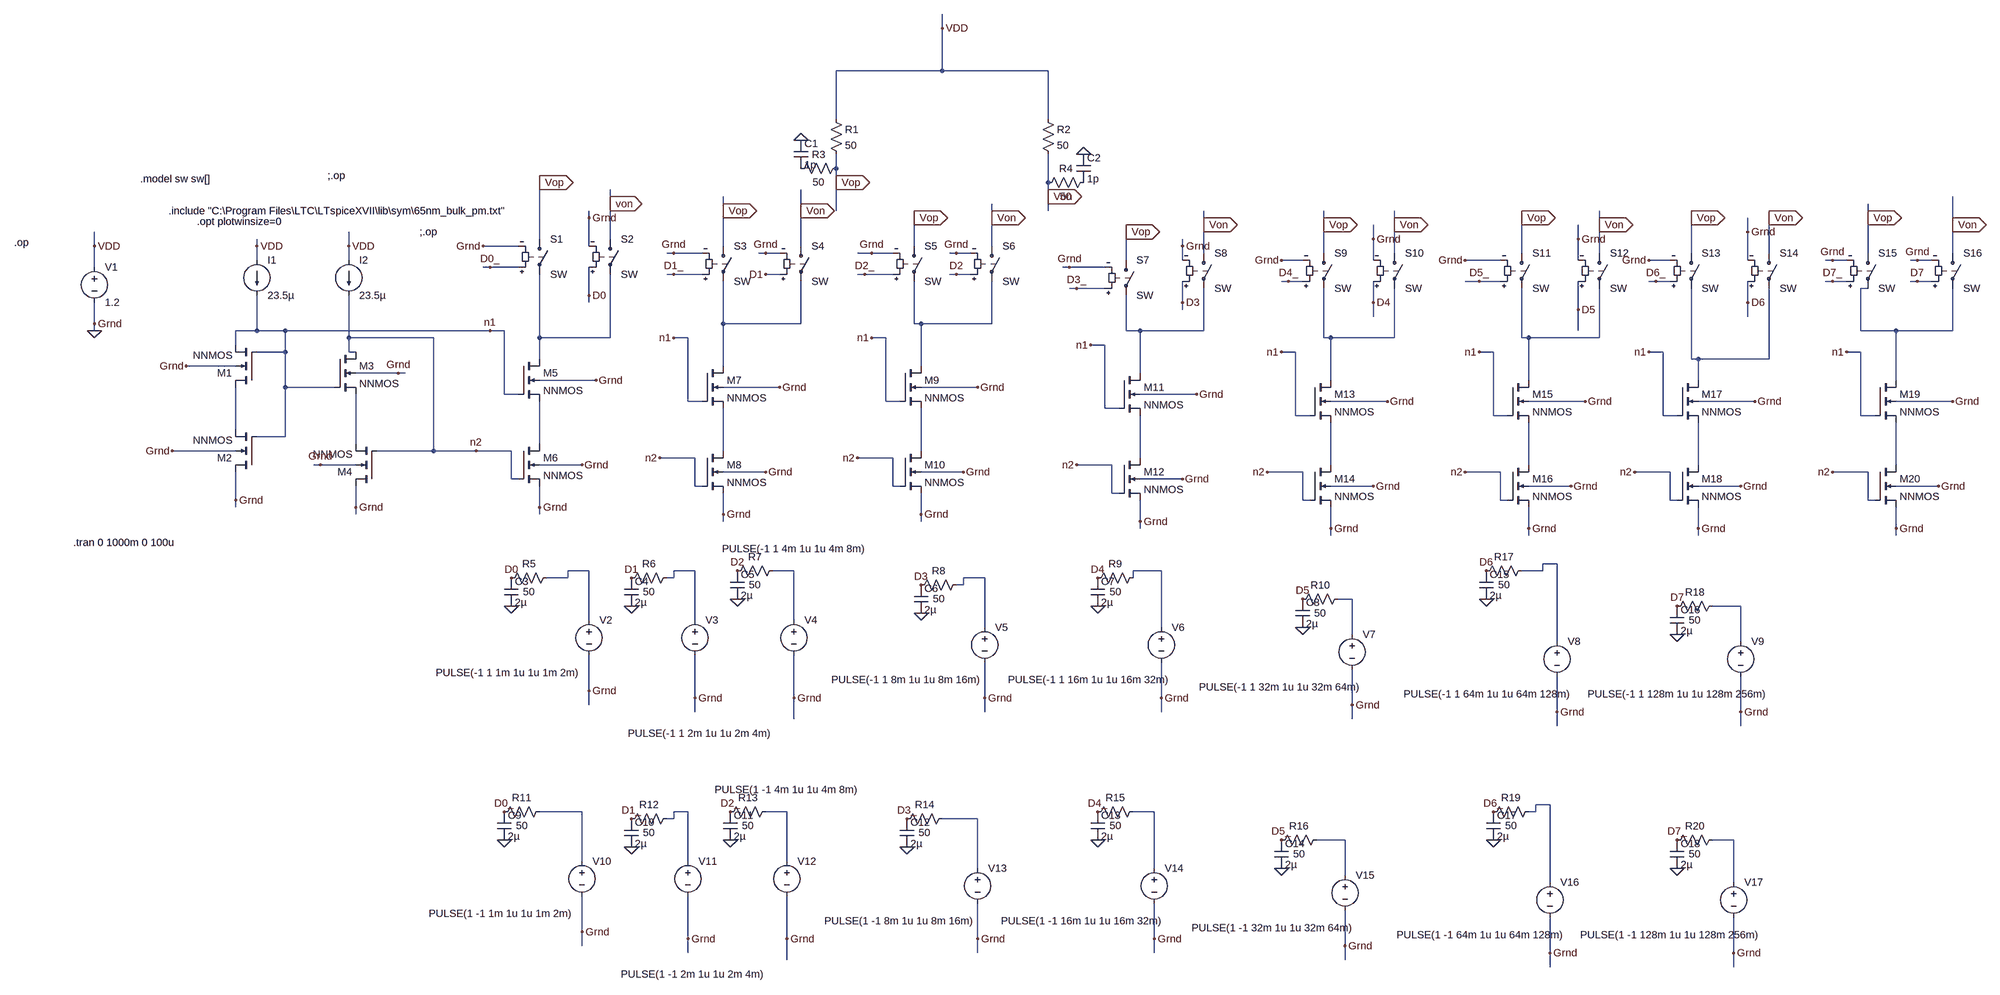
[diagram p0: schematic 8bitDACcurrent_steering.asc]
8bitDACcurrent_steering.asc, the LTspice schematic file:
Version 4
SHEET 1 3984 1160
WIRE 1616 -1056 1616 -1088
WIRE 1616 -960 1616 -1056
WIRE 1616 -960 1376 -960
WIRE 1856 -960 1616 -960
WIRE 1376 -832 1376 -960
WIRE 1856 -832 1856 -960
WIRE 1376 -720 1376 -752
WIRE 704 -688 704 -704
WIRE 1376 -688 1376 -720
WIRE 1856 -688 1856 -752
WIRE 1856 -656 1856 -688
WIRE 864 -640 864 -672
WIRE 1120 -624 1120 -656
WIRE 1296 -624 1296 -672
WIRE 1376 -624 1376 -688
WIRE 1856 -624 1856 -656
WIRE 816 -608 816 -624
WIRE 1552 -608 1552 -624
WIRE 1728 -608 1728 -640
WIRE 2928 -608 2928 -624
WIRE 3312 -608 3312 -624
WIRE 3488 -608 3488 -624
WIRE 3712 -608 3712 -640
WIRE 2208 -592 2208 -624
WIRE 2480 -592 2480 -624
WIRE 2640 -592 2640 -624
WIRE 3104 -592 3104 -624
WIRE 3904 -592 3904 -656
WIRE 2032 -576 2032 -592
WIRE 3440 -576 3440 -608
WIRE 704 -560 704 -688
WIRE 864 -560 864 -640
WIRE 2592 -560 2592 -592
WIRE 3056 -560 3056 -592
WIRE -304 -544 -304 -576
WIRE 64 -544 64 -560
WIRE 272 -544 272 -576
WIRE 656 -544 576 -544
WIRE 816 -544 816 -608
WIRE 1120 -544 1120 -624
WIRE 1296 -544 1296 -624
WIRE 1552 -544 1552 -608
WIRE 1728 -544 1728 -608
WIRE 2160 -544 2160 -560
WIRE 1008 -528 992 -528
WIRE 1072 -528 1008 -528
WIRE 1216 -528 1200 -528
WIRE 1248 -528 1216 -528
WIRE 1456 -528 1424 -528
WIRE 1504 -528 1456 -528
WIRE 1648 -528 1632 -528
WIRE 1680 -528 1648 -528
WIRE 2208 -528 2208 -592
WIRE 2480 -528 2480 -592
WIRE 2640 -528 2640 -592
WIRE 2928 -528 2928 -608
WIRE 3104 -528 3104 -592
WIRE 3312 -528 3312 -608
WIRE 3488 -528 3488 -608
WIRE 3712 -528 3712 -608
WIRE 3904 -528 3904 -592
WIRE 64 -512 64 -544
WIRE 272 -512 272 -544
WIRE 2032 -512 2032 -576
WIRE 2160 -512 2160 -544
WIRE 2432 -512 2384 -512
WIRE 2592 -512 2592 -560
WIRE 2880 -512 2800 -512
WIRE 3056 -512 3056 -560
WIRE 3264 -512 3216 -512
WIRE 3440 -512 3440 -576
WIRE 3632 -512 3616 -512
WIRE 3664 -512 3632 -512
WIRE 3824 -512 3808 -512
WIRE 3856 -512 3824 -512
WIRE -304 -496 -304 -544
WIRE 592 -496 576 -496
WIRE 656 -496 592 -496
WIRE 1904 -496 1888 -496
WIRE 1984 -496 1904 -496
WIRE 1008 -480 992 -480
WIRE 1072 -480 1008 -480
WIRE 1248 -480 1216 -480
WIRE 1440 -480 1424 -480
WIRE 1504 -480 1440 -480
WIRE 1648 -480 1632 -480
WIRE 1680 -480 1648 -480
WIRE 2400 -464 2384 -464
WIRE 2432 -464 2400 -464
WIRE 2832 -464 2800 -464
WIRE 2880 -464 2832 -464
WIRE 3232 -464 3216 -464
WIRE 3264 -464 3232 -464
WIRE 3632 -464 3616 -464
WIRE 3664 -464 3632 -464
WIRE 3824 -464 3808 -464
WIRE 3856 -464 3824 -464
WIRE 1920 -448 1904 -448
WIRE 1984 -448 1920 -448
WIRE 3712 -448 3696 -448
WIRE 816 -432 816 -496
WIRE 816 -416 816 -432
WIRE 2160 -416 2160 -464
WIRE 2592 -416 2592 -464
WIRE 3440 -416 3440 -464
WIRE 2160 -400 2160 -416
WIRE 3056 -400 3056 -464
WIRE 2592 -384 2592 -416
WIRE 3440 -384 3440 -416
WIRE -304 -368 -304 -416
WIRE 1120 -368 1120 -464
WIRE 1296 -368 1296 -464
WIRE 1296 -368 1120 -368
WIRE 1552 -368 1552 -464
WIRE 1568 -368 1552 -368
WIRE 1728 -368 1728 -464
WIRE 1728 -368 1568 -368
WIRE -304 -352 -304 -368
WIRE 64 -352 64 -432
WIRE 64 -352 16 -352
WIRE 128 -352 64 -352
WIRE 592 -352 128 -352
WIRE 624 -352 592 -352
WIRE 2032 -352 2032 -432
WIRE 2064 -352 2032 -352
WIRE 2208 -352 2208 -448
WIRE 2208 -352 2064 -352
WIRE 3056 -352 3056 -400
WIRE 3696 -352 3696 -448
WIRE 3776 -352 3696 -352
WIRE 3904 -352 3904 -448
WIRE 3904 -352 3776 -352
WIRE 272 -336 272 -432
WIRE 464 -336 272 -336
WIRE 704 -336 704 -480
WIRE 864 -336 864 -480
WIRE 864 -336 704 -336
WIRE 1040 -336 1008 -336
WIRE 1488 -336 1456 -336
WIRE 2480 -336 2480 -448
WIRE 2496 -336 2480 -336
WIRE 2640 -336 2640 -448
WIRE 2640 -336 2496 -336
WIRE 2928 -336 2928 -448
WIRE 2944 -336 2928 -336
WIRE 3104 -336 3104 -448
WIRE 3104 -336 2944 -336
WIRE 16 -320 16 -352
WIRE 1984 -320 1952 -320
WIRE 128 -304 128 -352
WIRE 128 -304 64 -304
WIRE 272 -304 272 -336
WIRE 288 -304 272 -304
WIRE 2416 -304 2384 -304
WIRE 2864 -304 2832 -304
WIRE 3248 -304 3216 -304
WIRE 3696 -304 3664 -304
WIRE 704 -288 704 -336
WIRE 3312 -288 3312 -448
WIRE 3328 -288 3312 -288
WIRE 3488 -288 3488 -448
WIRE 3488 -288 3328 -288
WIRE 16 -272 -96 -272
WIRE 1120 -272 1120 -368
WIRE 1568 -272 1568 -368
WIRE 384 -256 288 -256
WIRE 400 -256 384 -256
WIRE 2064 -256 2064 -352
WIRE 832 -240 704 -240
WIRE 2496 -240 2496 -336
WIRE 2944 -240 2944 -336
WIRE 3328 -240 3328 -288
WIRE 3776 -240 3776 -352
WIRE 128 -224 128 -304
WIRE 240 -224 128 -224
WIRE 1248 -224 1120 -224
WIRE 1696 -224 1568 -224
WIRE 624 -208 624 -352
WIRE 656 -208 624 -208
WIRE 2192 -208 2064 -208
WIRE 1040 -192 1040 -336
WIRE 1072 -192 1040 -192
WIRE 1488 -192 1488 -336
WIRE 1520 -192 1488 -192
WIRE 2624 -192 2496 -192
WIRE 3072 -192 2944 -192
WIRE 3456 -192 3328 -192
WIRE 3904 -192 3776 -192
WIRE 1984 -176 1984 -320
WIRE 2016 -176 1984 -176
WIRE 2416 -160 2416 -304
WIRE 2448 -160 2416 -160
WIRE 2864 -160 2864 -304
WIRE 2896 -160 2864 -160
WIRE 3248 -160 3248 -304
WIRE 3280 -160 3248 -160
WIRE 3696 -160 3696 -304
WIRE 3728 -160 3696 -160
WIRE 16 -128 16 -224
WIRE 128 -112 128 -224
WIRE 128 -112 64 -112
WIRE 288 -96 288 -208
WIRE 704 -96 704 -192
WIRE 16 -80 -128 -80
WIRE 464 -80 464 -336
WIRE 464 -80 336 -80
WIRE 560 -80 464 -80
WIRE 640 -80 560 -80
WIRE 1120 -80 1120 -176
WIRE 1568 -80 1568 -176
WIRE 1056 -64 976 -64
WIRE 1504 -64 1424 -64
WIRE 2064 -64 2064 -160
WIRE 208 -48 192 -48
WIRE 288 -48 208 -48
WIRE 800 -48 704 -48
WIRE 2000 -48 1920 -48
WIRE 2496 -48 2496 -144
WIRE 2944 -48 2944 -144
WIRE 3328 -48 3328 -144
WIRE 3776 -48 3776 -144
WIRE 1216 -32 1120 -32
WIRE 1664 -32 1568 -32
WIRE 2432 -32 2352 -32
WIRE 2880 -32 2800 -32
WIRE 3264 -32 3184 -32
WIRE 3712 -32 3632 -32
WIRE 640 -16 640 -80
WIRE 656 -16 640 -16
WIRE 2160 -16 2064 -16
WIRE 1056 0 1056 -64
WIRE 1072 0 1056 0
WIRE 1504 0 1504 -64
WIRE 1520 0 1504 0
WIRE 2592 0 2496 0
WIRE 3040 0 2944 0
WIRE 3424 0 3328 0
WIRE 3872 0 3776 0
WIRE 2000 16 2000 -48
WIRE 2016 16 2000 16
WIRE 16 32 16 -32
WIRE 2432 32 2432 -32
WIRE 2448 32 2432 32
WIRE 2880 32 2880 -32
WIRE 2896 32 2880 32
WIRE 3264 32 3264 -32
WIRE 3280 32 3264 32
WIRE 3712 32 3712 -32
WIRE 3728 32 3712 32
WIRE 16 48 16 32
WIRE 288 48 288 0
WIRE 704 48 704 0
WIRE 288 64 288 48
WIRE 704 64 704 48
WIRE 1120 64 1120 16
WIRE 1568 64 1568 16
WIRE 1120 80 1120 64
WIRE 1568 80 1568 64
WIRE 2064 80 2064 32
WIRE 2064 96 2064 80
WIRE 2496 96 2496 48
WIRE 2944 96 2944 48
WIRE 3328 96 3328 48
WIRE 3776 96 3776 48
WIRE 2496 112 2496 96
WIRE 2944 112 2944 96
WIRE 3328 112 3328 96
WIRE 3776 112 3776 96
WIRE 3008 176 2976 176
WIRE 816 192 768 192
WIRE 1056 192 1008 192
WIRE 1280 192 1232 192
WIRE 2112 192 2048 192
WIRE 2976 192 2976 176
WIRE 2976 192 2928 192
WIRE 768 208 768 192
WIRE 768 208 720 208
WIRE 1008 208 1008 192
WIRE 1008 208 992 208
WIRE 1712 208 1664 208
WIRE 2048 208 2048 192
WIRE 1664 224 1664 208
WIRE 1664 224 1648 224
WIRE 2544 256 2512 256
WIRE 3424 272 3360 272
WIRE 816 304 816 192
WIRE 1056 304 1056 192
WIRE 1280 304 1280 192
WIRE 1712 320 1712 208
WIRE 2112 320 2112 192
WIRE 2544 336 2544 256
WIRE 3008 352 3008 176
WIRE 3424 352 3424 272
WIRE 816 464 816 384
WIRE 1056 480 1056 384
WIRE 1280 480 1280 384
WIRE 1712 480 1712 400
WIRE 2112 480 2112 400
WIRE 816 496 816 464
WIRE 2544 496 2544 416
WIRE 1056 512 1056 480
WIRE 1712 512 1712 480
WIRE 2112 512 2112 480
WIRE 3008 512 3008 432
WIRE 3424 512 3424 432
WIRE 1280 528 1280 480
WIRE 2544 528 2544 496
WIRE 3008 544 3008 512
WIRE 3424 544 3424 512
WIRE 2992 752 2960 752
WIRE 800 768 704 768
WIRE 1040 768 1008 768
WIRE 1264 768 1216 768
WIRE 2096 768 2048 768
WIRE 2960 768 2960 752
WIRE 2960 768 2944 768
WIRE 1008 784 1008 768
WIRE 1008 784 992 784
WIRE 1696 784 1616 784
WIRE 2528 832 2464 832
WIRE 3408 832 3360 832
WIRE 800 880 800 768
WIRE 1040 880 1040 768
WIRE 1264 880 1264 768
WIRE 1696 896 1696 784
WIRE 2096 896 2096 768
WIRE 2528 912 2528 832
WIRE 2992 928 2992 752
WIRE 3408 928 3408 832
WIRE 800 1040 800 960
WIRE 1040 1056 1040 960
WIRE 1264 1056 1264 960
WIRE 1696 1056 1696 976
WIRE 2096 1056 2096 976
WIRE 800 1072 800 1040
WIRE 2528 1072 2528 992
WIRE 1040 1088 1040 1056
WIRE 1696 1088 1696 1056
WIRE 2096 1088 2096 1056
WIRE 2992 1088 2992 1008
WIRE 3408 1088 3408 1008
WIRE 1264 1104 1264 1056
WIRE 2528 1104 2528 1072
WIRE 2992 1120 2992 1088
WIRE 3408 1120 3408 1088
FLAG -304 -352 0
FLAG -304 -544 VDD
FLAG 64 -544 VDD
FLAG 272 -544 VDD
FLAG -304 -368 Grnd
FLAG -96 -272 Grnd
FLAG -128 -80 Grnd
FLAG 16 32 Grnd
FLAG 288 48 Grnd
FLAG 208 -48 Grnd
FLAG 800 -48 Grnd
FLAG 704 48 Grnd
FLAG 832 -240 Grnd
FLAG 384 -256 Grnd
FLAG 816 464 Grnd
FLAG 1056 480 Grnd
FLAG 1280 480 Grnd
FLAG 640 208 D0
FLAG 912 208 D1
FLAG 1152 192 D2
FLAG 1712 480 Grnd
FLAG 2112 480 Grnd
FLAG 2544 496 Grnd
FLAG 3008 512 Grnd
FLAG 3424 512 Grnd
FLAG 1568 224 D3
FLAG 1968 208 D4
FLAG 2432 256 D5
FLAG 2848 192 D6
FLAG 3280 272 D7
FLAG 592 -352 n1
FLAG 560 -80 n2
FLAG 1216 -32 Grnd
FLAG 1120 64 Grnd
FLAG 1248 -224 Grnd
FLAG 1008 -336 n1
FLAG 976 -64 n2
FLAG 1664 -32 Grnd
FLAG 1568 64 Grnd
FLAG 1696 -224 Grnd
FLAG 1456 -336 n1
FLAG 1424 -64 n2
FLAG 2160 -16 Grnd
FLAG 2064 80 Grnd
FLAG 2192 -208 Grnd
FLAG 1952 -320 n1
FLAG 1920 -48 n2
FLAG 2592 0 Grnd
FLAG 2496 96 Grnd
FLAG 2624 -192 Grnd
FLAG 2384 -304 n1
FLAG 2352 -32 n2
FLAG 3040 0 Grnd
FLAG 2944 96 Grnd
FLAG 3072 -192 Grnd
FLAG 2832 -304 n1
FLAG 2800 -32 n2
FLAG 3424 0 Grnd
FLAG 3328 96 Grnd
FLAG 3456 -192 Grnd
FLAG 3216 -304 n1
FLAG 3184 -32 n2
FLAG 3872 0 Grnd
FLAG 3776 96 Grnd
FLAG 3904 -192 Grnd
FLAG 3664 -304 n1
FLAG 3632 -32 n2
FLAG 800 1040 Grnd
FLAG 1040 1056 Grnd
FLAG 1264 1056 Grnd
FLAG 624 768 D0_
FLAG 912 784 D1_
FLAG 1136 768 D2_
FLAG 1696 1056 Grnd
FLAG 2096 1056 Grnd
FLAG 2528 1072 Grnd
FLAG 2992 1088 Grnd
FLAG 3408 1088 Grnd
FLAG 1536 784 D3_
FLAG 1968 768 D4_
FLAG 2384 832 D5_
FLAG 2864 768 D6_
FLAG 3280 832 D7_
FLAG 1376 -688 Vop
IOPIN 1376 -688 Out
FLAG 1856 -656 Von
IOPIN 1856 -656 Out
FLAG 1616 -1056 VDD
FLAG 704 -688 Vop
IOPIN 704 -688 Out
FLAG 1120 -624 Vop
IOPIN 1120 -624 Out
FLAG 1552 -608 Vop
IOPIN 1552 -608 Out
FLAG 2032 -576 Vop
IOPIN 2032 -576 Out
FLAG 2480 -592 Vop
IOPIN 2480 -592 Out
FLAG 2928 -608 Vop
IOPIN 2928 -608 Out
FLAG 3312 -608 Vop
IOPIN 3312 -608 Out
FLAG 3712 -608 Vop
IOPIN 3712 -608 Out
FLAG 1296 -624 Von
IOPIN 1296 -624 Out
FLAG 1728 -608 Von
IOPIN 1728 -608 Out
FLAG 2208 -592 Von
IOPIN 2208 -592 Out
FLAG 2640 -592 Von
IOPIN 2640 -592 Out
FLAG 3104 -592 Von
IOPIN 3104 -592 Out
FLAG 3488 -608 Von
IOPIN 3488 -608 Out
FLAG 3904 -592 Von
IOPIN 3904 -592 Out
FLAG 576 -544 Grnd
FLAG 816 -608 Grnd
FLAG 1008 -528 Grnd
FLAG 1216 -528 Grnd
FLAG 1456 -528 Grnd
FLAG 1648 -528 Grnd
FLAG 1904 -496 Grnd
FLAG 2160 -544 Grnd
FLAG 2384 -512 Grnd
FLAG 2592 -560 Grnd
FLAG 2800 -512 Grnd
FLAG 3056 -560 Grnd
FLAG 3216 -512 Grnd
FLAG 3440 -576 Grnd
FLAG 3632 -512 Grnd
FLAG 3824 -512 Grnd
FLAG 816 -432 D0
FLAG 1216 -480 D1
FLAG 592 -496 D0_
FLAG 1008 -480 D1_
FLAG 1440 -480 D2_
FLAG 1648 -480 D2
FLAG 1920 -448 D3_
FLAG 2160 -416 D3
FLAG 2400 -464 D4_
FLAG 2592 -416 D4
FLAG 2832 -464 D5_
FLAG 3056 -400 D5
FLAG 3232 -464 D6_
FLAG 3440 -416 D6
FLAG 3632 -464 D7_
FLAG 3824 -464 D7
FLAG 1296 -784 0
FLAG 1936 -752 0
FLAG 640 272 0
FLAG 912 272 0
FLAG 1152 256 0
FLAG 1568 288 0
FLAG 1968 272 0
FLAG 2432 320 0
FLAG 624 832 0
FLAG 912 848 0
FLAG 1136 832 0
FLAG 1536 848 0
FLAG 1968 832 0
FLAG 2384 896 0
FLAG 2848 256 0
FLAG 3280 336 0
FLAG 2864 832 0
FLAG 3280 896 0
FLAG 864 -640 von
IOPIN 864 -640 Out
SYMBOL current 64 -512 R0
WINDOW 123 0 0 Left 0
WINDOW 39 0 0 Left 0
SYMATTR InstName I1
SYMATTR Value 23.5µ
SYMBOL current 272 -512 R0
WINDOW 123 0 0 Left 0
WINDOW 39 0 0 Left 0
SYMATTR InstName I2
SYMATTR Value 23.5µ
SYMBOL nmos4 64 -224 R180
SYMATTR InstName M1
SYMATTR Value NNMOS
SYMATTR Value2 l=0.3u w=6u
SYMBOL nmos4 64 -32 R180
SYMATTR InstName M2
SYMATTR Value NNMOS
SYMATTR Value2 l=0.3u w=2u
SYMBOL nmos4 240 -304 R0
SYMATTR InstName M3
SYMATTR Value NNMOS
SYMATTR Value2 l=0.3u w=6u
SYMBOL nmos4 336 0 R180
SYMATTR InstName M4
SYMATTR Value NNMOS
SYMATTR Value2 l=0.3u w=6u
SYMBOL nmos4 656 -288 R0
SYMATTR InstName M5
SYMATTR Value NNMOS
SYMATTR Value2 l=0.3u w=6u
SYMBOL nmos4 656 -96 R0
SYMATTR InstName M6
SYMATTR Value NNMOS
SYMATTR Value2 l=0.3u w=6u
SYMBOL voltage -304 -512 R0
WINDOW 123 0 0 Left 0
WINDOW 39 0 0 Left 0
SYMATTR InstName V1
SYMATTR Value 1.2
SYMBOL voltage 816 288 R0
WINDOW 3 -347 135 Left 2
WINDOW 123 0 0 Left 0
WINDOW 39 0 0 Left 0
SYMATTR Value PULSE(-1 1 1m 1u 1u 1m 2m)
SYMATTR InstName V2
SYMBOL voltage 1056 288 R0
WINDOW 3 -152 272 Left 2
WINDOW 123 0 0 Left 0
WINDOW 39 0 0 Left 0
SYMATTR Value PULSE(-1 1 2m 1u 1u 2m 4m)
SYMATTR InstName V3
SYMBOL voltage 1280 288 R0
WINDOW 3 -163 -146 Left 2
WINDOW 123 0 0 Left 0
WINDOW 39 0 0 Left 0
SYMATTR Value PULSE(-1 1 4m 1u 1u 4m 8m)
SYMATTR InstName V4
SYMBOL voltage 1712 304 R0
WINDOW 3 -347 135 Left 2
WINDOW 123 0 0 Left 0
WINDOW 39 0 0 Left 0
SYMATTR Value PULSE(-1 1 8m 1u 1u 8m 16m)
SYMATTR InstName V5
SYMBOL voltage 2112 304 R0
WINDOW 3 -347 135 Left 2
WINDOW 123 0 0 Left 0
WINDOW 39 0 0 Left 0
SYMATTR Value PULSE(-1 1 16m 1u 1u 16m 32m)
SYMATTR InstName V6
SYMBOL voltage 2544 320 R0
WINDOW 3 -347 135 Left 2
WINDOW 123 0 0 Left 0
WINDOW 39 0 0 Left 0
SYMATTR Value PULSE(-1 1 32m 1u 1u 32m 64m)
SYMATTR InstName V7
SYMBOL voltage 3008 336 R0
WINDOW 3 -347 135 Left 2
WINDOW 123 0 0 Left 0
WINDOW 39 0 0 Left 0
SYMATTR Value PULSE(-1 1 64m 1u 1u 64m 128m)
SYMATTR InstName V8
SYMBOL voltage 3424 336 R0
WINDOW 3 -347 135 Left 2
WINDOW 123 0 0 Left 0
WINDOW 39 0 0 Left 0
SYMATTR Value PULSE(-1 1 128m 1u 1u 128m 256m)
SYMATTR InstName V9
SYMBOL nmos4 1072 -272 R0
SYMATTR InstName M7
SYMATTR Value NNMOS
SYMATTR Value2 l=0.3u w=6u m=2
SYMBOL nmos4 1072 -80 R0
SYMATTR InstName M8
SYMATTR Value NNMOS
SYMATTR Value2 l=0.3u w=6u m=2
SYMBOL nmos4 1520 -272 R0
SYMATTR InstName M9
SYMATTR Value NNMOS
SYMATTR Value2 l=0.3u w=6u m=4
SYMBOL nmos4 1520 -80 R0
SYMATTR InstName M10
SYMATTR Value NNMOS
SYMATTR Value2 l=0.3u w=6u m=4
SYMBOL nmos4 2016 -256 R0
SYMATTR InstName M11
SYMATTR Value NNMOS
SYMATTR Value2 l=0.3u w=6u m=8
SYMBOL nmos4 2016 -64 R0
SYMATTR InstName M12
SYMATTR Value NNMOS
SYMATTR Value2 l=0.3u w=6u m=8
SYMBOL nmos4 2448 -240 R0
SYMATTR InstName M13
SYMATTR Value NNMOS
SYMATTR Value2 l=0.3u w=6u m=16
SYMBOL nmos4 2448 -48 R0
SYMATTR InstName M14
SYMATTR Value NNMOS
SYMATTR Value2 l=0.3u w=6u m=16
SYMBOL nmos4 2896 -240 R0
SYMATTR InstName M15
SYMATTR Value NNMOS
SYMATTR Value2 l=0.3u w=6u m=32
SYMBOL nmos4 2896 -48 R0
SYMATTR InstName M16
SYMATTR Value NNMOS
SYMATTR Value2 l=0.3u w=6u m=32
SYMBOL nmos4 3280 -240 R0
SYMATTR InstName M17
SYMATTR Value NNMOS
SYMATTR Value2 l=0.3u w=6u m=64
SYMBOL nmos4 3280 -48 R0
SYMATTR InstName M18
SYMATTR Value NNMOS
SYMATTR Value2 l=0.3u w=6u m=64
SYMBOL nmos4 3728 -240 R0
SYMATTR InstName M19
SYMATTR Value NNMOS
SYMATTR Value2 l=0.3u w=6u m=128
SYMBOL nmos4 3728 -48 R0
SYMATTR InstName M20
SYMATTR Value NNMOS
SYMATTR Value2 l=0.3u w=6u m=128
SYMBOL voltage 800 864 R0
WINDOW 3 -347 135 Left 2
WINDOW 123 0 0 Left 0
WINDOW 39 0 0 Left 0
SYMATTR Value PULSE(1 -1 1m 1u 1u 1m 2m)
SYMATTR InstName V10
SYMBOL voltage 1040 864 R0
WINDOW 3 -152 272 Left 2
WINDOW 123 0 0 Left 0
WINDOW 39 0 0 Left 0
SYMATTR Value PULSE(1 -1 2m 1u 1u 2m 4m)
SYMATTR InstName V11
SYMBOL voltage 1264 864 R0
WINDOW 3 -163 -146 Left 2
WINDOW 123 0 0 Left 0
WINDOW 39 0 0 Left 0
SYMATTR Value PULSE(1 -1 4m 1u 1u 4m 8m)
SYMATTR InstName V12
SYMBOL voltage 1696 880 R0
WINDOW 3 -347 135 Left 2
WINDOW 123 0 0 Left 0
WINDOW 39 0 0 Left 0
SYMATTR Value PULSE(1 -1 8m 1u 1u 8m 16m)
SYMATTR InstName V13
SYMBOL voltage 2096 880 R0
WINDOW 3 -347 135 Left 2
WINDOW 123 0 0 Left 0
WINDOW 39 0 0 Left 0
SYMATTR Value PULSE(1 -1 16m 1u 1u 16m 32m)
SYMATTR InstName V14
SYMBOL voltage 2528 896 R0
WINDOW 3 -347 135 Left 2
WINDOW 123 0 0 Left 0
WINDOW 39 0 0 Left 0
SYMATTR Value PULSE(1 -1 32m 1u 1u 32m 64m)
SYMATTR InstName V15
SYMBOL voltage 2992 912 R0
WINDOW 3 -347 135 Left 2
WINDOW 123 0 0 Left 0
WINDOW 39 0 0 Left 0
SYMATTR Value PULSE(1 -1 64m 1u 1u 64m 128m)
SYMATTR InstName V16
SYMBOL voltage 3408 912 R0
WINDOW 3 -347 135 Left 2
WINDOW 123 0 0 Left 0
WINDOW 39 0 0 Left 0
SYMATTR Value PULSE(1 -1 128m 1u 1u 128m 256m)
SYMATTR InstName V17
SYMBOL res 1360 -848 R0
SYMATTR InstName R1
SYMATTR Value 50
SYMBOL res 1840 -848 R0
SYMATTR InstName R2
SYMATTR Value 50
SYMBOL sw 704 -576 R0
SYMATTR InstName S1
SYMBOL sw 864 -576 R0
SYMATTR InstName S2
SYMBOL sw 1120 -560 R0
SYMATTR InstName S3
SYMBOL sw 1296 -560 R0
SYMATTR InstName S4
SYMBOL sw 1552 -560 R0
SYMATTR InstName S5
SYMBOL sw 1728 -560 R0
SYMATTR InstName S6
SYMBOL sw 2032 -528 R0
SYMATTR InstName S7
SYMBOL sw 2208 -544 R0
SYMATTR InstName S8
SYMBOL sw 2480 -544 R0
SYMATTR InstName S9
SYMBOL sw 2640 -544 R0
SYMATTR InstName S10
SYMBOL sw 2928 -544 R0
SYMATTR InstName S11
SYMBOL sw 3104 -544 R0
SYMATTR InstName S12
SYMBOL sw 3312 -544 R0
SYMATTR InstName S13
SYMBOL sw 3488 -544 R0
SYMATTR InstName S14
SYMBOL sw 3712 -544 R0
SYMATTR InstName S15
SYMBOL sw 3904 -544 R0
SYMATTR InstName S16
SYMBOL res 1392 -736 R90
WINDOW 0 0 56 VBottom 2
WINDOW 3 32 56 VTop 2
SYMATTR InstName R3
SYMATTR Value 50
SYMBOL res 1952 -704 R90
WINDOW 0 0 56 VBottom 2
WINDOW 3 32 56 VTop 2
SYMATTR InstName R4
SYMATTR Value 50
SYMBOL cap 1280 -784 R0
SYMATTR InstName C1
SYMATTR Value 1p
SYMBOL cap 1920 -752 R0
SYMATTR InstName C2
SYMATTR Value 1p
SYMBOL res 624 224 R270
WINDOW 0 32 56 VTop 2
WINDOW 3 0 56 VBottom 2
SYMATTR InstName R5
SYMATTR Value 50
SYMBOL cap 624 208 R0
SYMATTR InstName C3
SYMATTR Value 2µ
SYMBOL res 896 224 R270
WINDOW 0 32 56 VTop 2
WINDOW 3 0 56 VBottom 2
SYMATTR InstName R6
SYMATTR Value 50
SYMBOL cap 896 208 R0
SYMATTR InstName C4
SYMATTR Value 2µ
SYMBOL res 1136 208 R270
WINDOW 0 32 56 VTop 2
WINDOW 3 0 56 VBottom 2
SYMATTR InstName R7
SYMATTR Value 50
SYMBOL cap 1136 192 R0
SYMATTR InstName C5
SYMATTR Value 2µ
SYMBOL res 1552 240 R270
WINDOW 0 32 56 VTop 2
WINDOW 3 0 56 VBottom 2
SYMATTR InstName R8
SYMATTR Value 50
SYMBOL cap 1552 224 R0
SYMATTR InstName C6
SYMATTR Value 2µ
SYMBOL res 1952 224 R270
WINDOW 0 32 56 VTop 2
WINDOW 3 0 56 VBottom 2
SYMATTR InstName R9
SYMATTR Value 50
SYMBOL cap 1952 208 R0
SYMATTR InstName C7
SYMATTR Value 2µ
SYMBOL res 2416 272 R270
WINDOW 0 32 56 VTop 2
WINDOW 3 0 56 VBottom 2
SYMATTR InstName R10
SYMATTR Value 50
SYMBOL cap 2416 256 R0
SYMATTR InstName C8
SYMATTR Value 2µ
SYMBOL res 608 784 R270
WINDOW 0 32 56 VTop 2
WINDOW 3 0 56 VBottom 2
SYMATTR InstName R11
SYMATTR Value 50
SYMBOL cap 608 768 R0
SYMATTR InstName C9
SYMATTR Value 2µ
SYMBOL res 896 800 R270
WINDOW 0 32 56 VTop 2
WINDOW 3 0 56 VBottom 2
SYMATTR InstName R12
SYMATTR Value 50
SYMBOL cap 896 784 R0
SYMATTR InstName C10
SYMATTR Value 2µ
SYMBOL res 1120 784 R270
WINDOW 0 32 56 VTop 2
WINDOW 3 0 56 VBottom 2
SYMATTR InstName R13
SYMATTR Value 50
SYMBOL cap 1120 768 R0
SYMATTR InstName C11
SYMATTR Value 2µ
SYMBOL res 1520 800 R270
WINDOW 0 32 56 VTop 2
WINDOW 3 0 56 VBottom 2
SYMATTR InstName R14
SYMATTR Value 50
SYMBOL cap 1520 784 R0
SYMATTR InstName C12
SYMATTR Value 2µ
SYMBOL res 1952 784 R270
WINDOW 0 32 56 VTop 2
WINDOW 3 0 56 VBottom 2
SYMATTR InstName R15
SYMATTR Value 50
SYMBOL cap 1952 768 R0
SYMATTR InstName C13
SYMATTR Value 2µ
SYMBOL res 2368 848 R270
WINDOW 0 32 56 VTop 2
WINDOW 3 0 56 VBottom 2
SYMATTR InstName R16
SYMATTR Value 50
SYMBOL cap 2368 832 R0
SYMATTR InstName C14
SYMATTR Value 2µ
SYMBOL res 2832 208 R270
WINDOW 0 32 56 VTop 2
WINDOW 3 0 56 VBottom 2
SYMATTR InstName R17
SYMATTR Value 50
SYMBOL cap 2832 192 R0
SYMATTR InstName C15
SYMATTR Value 2µ
SYMBOL res 3264 288 R270
WINDOW 0 32 56 VTop 2
WINDOW 3 0 56 VBottom 2
SYMATTR InstName R18
SYMATTR Value 50
SYMBOL cap 3264 272 R0
SYMATTR InstName C16
SYMATTR Value 2µ
SYMBOL res 2848 784 R270
WINDOW 0 32 56 VTop 2
WINDOW 3 0 56 VBottom 2
SYMATTR InstName R19
SYMATTR Value 50
SYMBOL cap 2848 768 R0
SYMATTR InstName C17
SYMATTR Value 2µ
SYMBOL res 3264 848 R270
WINDOW 0 32 56 VTop 2
WINDOW 3 0 56 VBottom 2
SYMATTR InstName R20
SYMATTR Value 50
SYMBOL cap 3264 832 R0
SYMATTR InstName C18
SYMATTR Value 2µ
TEXT -136 -624 Left 2 !.include "C:\\Program Files\\LTC\\LTspiceXVII\\lib\\sym\\65nm_bulk_pm.txt"
TEXT -72 -600 Left 2 !.opt plotwinsize=0
TEXT 432 -576 Left 2 !;.op
TEXT -352 128 Left 2 !.tran 0 1000m 0 100u
TEXT -200 -696 Left 2 !.model sw sw[]
TEXT 224 -704 Left 2 !;.op
TEXT -1416 -552 Left 2 !.op

The netlist it stands for:
* 8bitDACcurrent_steering.asc
I1 VDD n1 23.5µ
I2 VDD n2 23.5µ
M1 N009 n1 n1 0 NNMOS l=0.3u w=6u
M2 0 n1 N009 0 NNMOS l=0.3u w=2u
M3 n2 n1 N010 0 NNMOS l=0.3u w=6u
M4 0 n2 N010 0 NNMOS l=0.3u w=6u
M5 N005 n1 N011 0 NNMOS l=0.3u w=6u
M6 N011 n2 0 0 NNMOS l=0.3u w=6u
V1 VDD 0 1.2
V2 N020 0 PULSE(-1 1 1m 1u 1u 1m 2m)
V3 N021 0 PULSE(-1 1 2m 1u 1u 2m 4m)
V4 N022 0 PULSE(-1 1 4m 1u 1u 4m 8m)
V5 N024 0 PULSE(-1 1 8m 1u 1u 8m 16m)
V6 N023 0 PULSE(-1 1 16m 1u 1u 16m 32m)
V7 N025 0 PULSE(-1 1 32m 1u 1u 32m 64m)
V8 N019 0 PULSE(-1 1 64m 1u 1u 64m 128m)
V9 N026 0 PULSE(-1 1 128m 1u 1u 128m 256m)
M7 N002 n1 N012 0 NNMOS l=0.3u w=6u m=2
M8 N012 n2 0 0 NNMOS l=0.3u w=6u m=2
M9 N003 n1 N013 0 NNMOS l=0.3u w=6u m=4
M10 N013 n2 0 0 NNMOS l=0.3u w=6u m=4
M11 N004 n1 N014 0 NNMOS l=0.3u w=6u m=8
M12 N014 n2 0 0 NNMOS l=0.3u w=6u m=8
M13 N006 n1 N015 0 NNMOS l=0.3u w=6u m=16
M14 N015 n2 0 0 NNMOS l=0.3u w=6u m=16
M15 N007 n1 N016 0 NNMOS l=0.3u w=6u m=32
M16 N016 n2 0 0 NNMOS l=0.3u w=6u m=32
M17 N008 n1 N017 0 NNMOS l=0.3u w=6u m=64
M18 N017 n2 0 0 NNMOS l=0.3u w=6u m=64
M19 N001 n1 N018 0 NNMOS l=0.3u w=6u m=128
M20 N018 n2 0 0 NNMOS l=0.3u w=6u m=128
V10 N028 0 PULSE(1 -1 1m 1u 1u 1m 2m)
V11 N029 0 PULSE(1 -1 2m 1u 1u 2m 4m)
V12 N030 0 PULSE(1 -1 4m 1u 1u 4m 8m)
V13 N032 0 PULSE(1 -1 8m 1u 1u 8m 16m)
V14 N031 0 PULSE(1 -1 16m 1u 1u 16m 32m)
V15 N033 0 PULSE(1 -1 32m 1u 1u 32m 64m)
V16 N027 0 PULSE(1 -1 64m 1u 1u 64m 128m)
V17 N034 0 PULSE(1 -1 128m 1u 1u 128m 256m)
R1 VDD Vop 50
R2 VDD Von 50
S1 Vop N005 D0_ 0 SW
S2 Von N005 D0 0 SW
S3 Vop N002 D1_ 0 SW
S4 Von N002 D1 0 SW
S5 Vop N003 D2_ 0 SW
S6 Von N003 D2 0 SW
S7 Vop N004 D3_ 0 SW
S8 Von N004 D3 0 SW
S9 Vop N006 D4_ 0 SW
S10 Von N006 D4 0 SW
S11 Vop N007 D5_ 0 SW
S12 Von N007 D5 0 SW
S13 Vop N008 D6_ 0 SW
S14 Von N008 D6 0 SW
S15 Vop N001 D7_ 0 SW
S16 Von N001 D7 0 SW
R3 Vop P001 50
R4 P002 Von 50
C1 0 P001 1p
C2 0 P002 1p
R5 D0 N020 50
C3 D0 0 2µ
R6 D1 N021 50
C4 D1 0 2µ
R7 D2 N022 50
C5 D2 0 2µ
R8 D3 N024 50
C6 D3 0 2µ
R9 D4 N023 50
C7 D4 0 2µ
R10 D5 N025 50
C8 D5 0 2µ
R11 D0_ N028 50
C9 D0_ 0 2µ
R12 D1_ N029 50
C10 D1_ 0 2µ
R13 D2_ N030 50
C11 D2_ 0 2µ
R14 D3_ N032 50
C12 D3_ 0 2µ
R15 D4_ N031 50
C13 D4_ 0 2µ
R16 D5_ N033 50
C14 D5_ 0 2µ
R17 D6 N019 50
C15 D6 0 2µ
R18 D7 N026 50
C16 D7 0 2µ
R19 D6_ N027 50
C17 D6_ 0 2µ
R20 D7_ N034 50
C18 D7_ 0 2µ
.model NMOS NMOS
.model PMOS PMOS
.lib standard.mos
.include "C:\Program Files\LTC\LTspiceXVII\lib\sym\65nm_bulk_pm.txt"
.opt plotwinsize=0
;.op
.tran 0 1000m 0 100u
.model sw sw[]
;.op
.op
.backanno
.end